# EAGLE design Magnetic-Imaging-Tile (EAGLE 9.5.2)
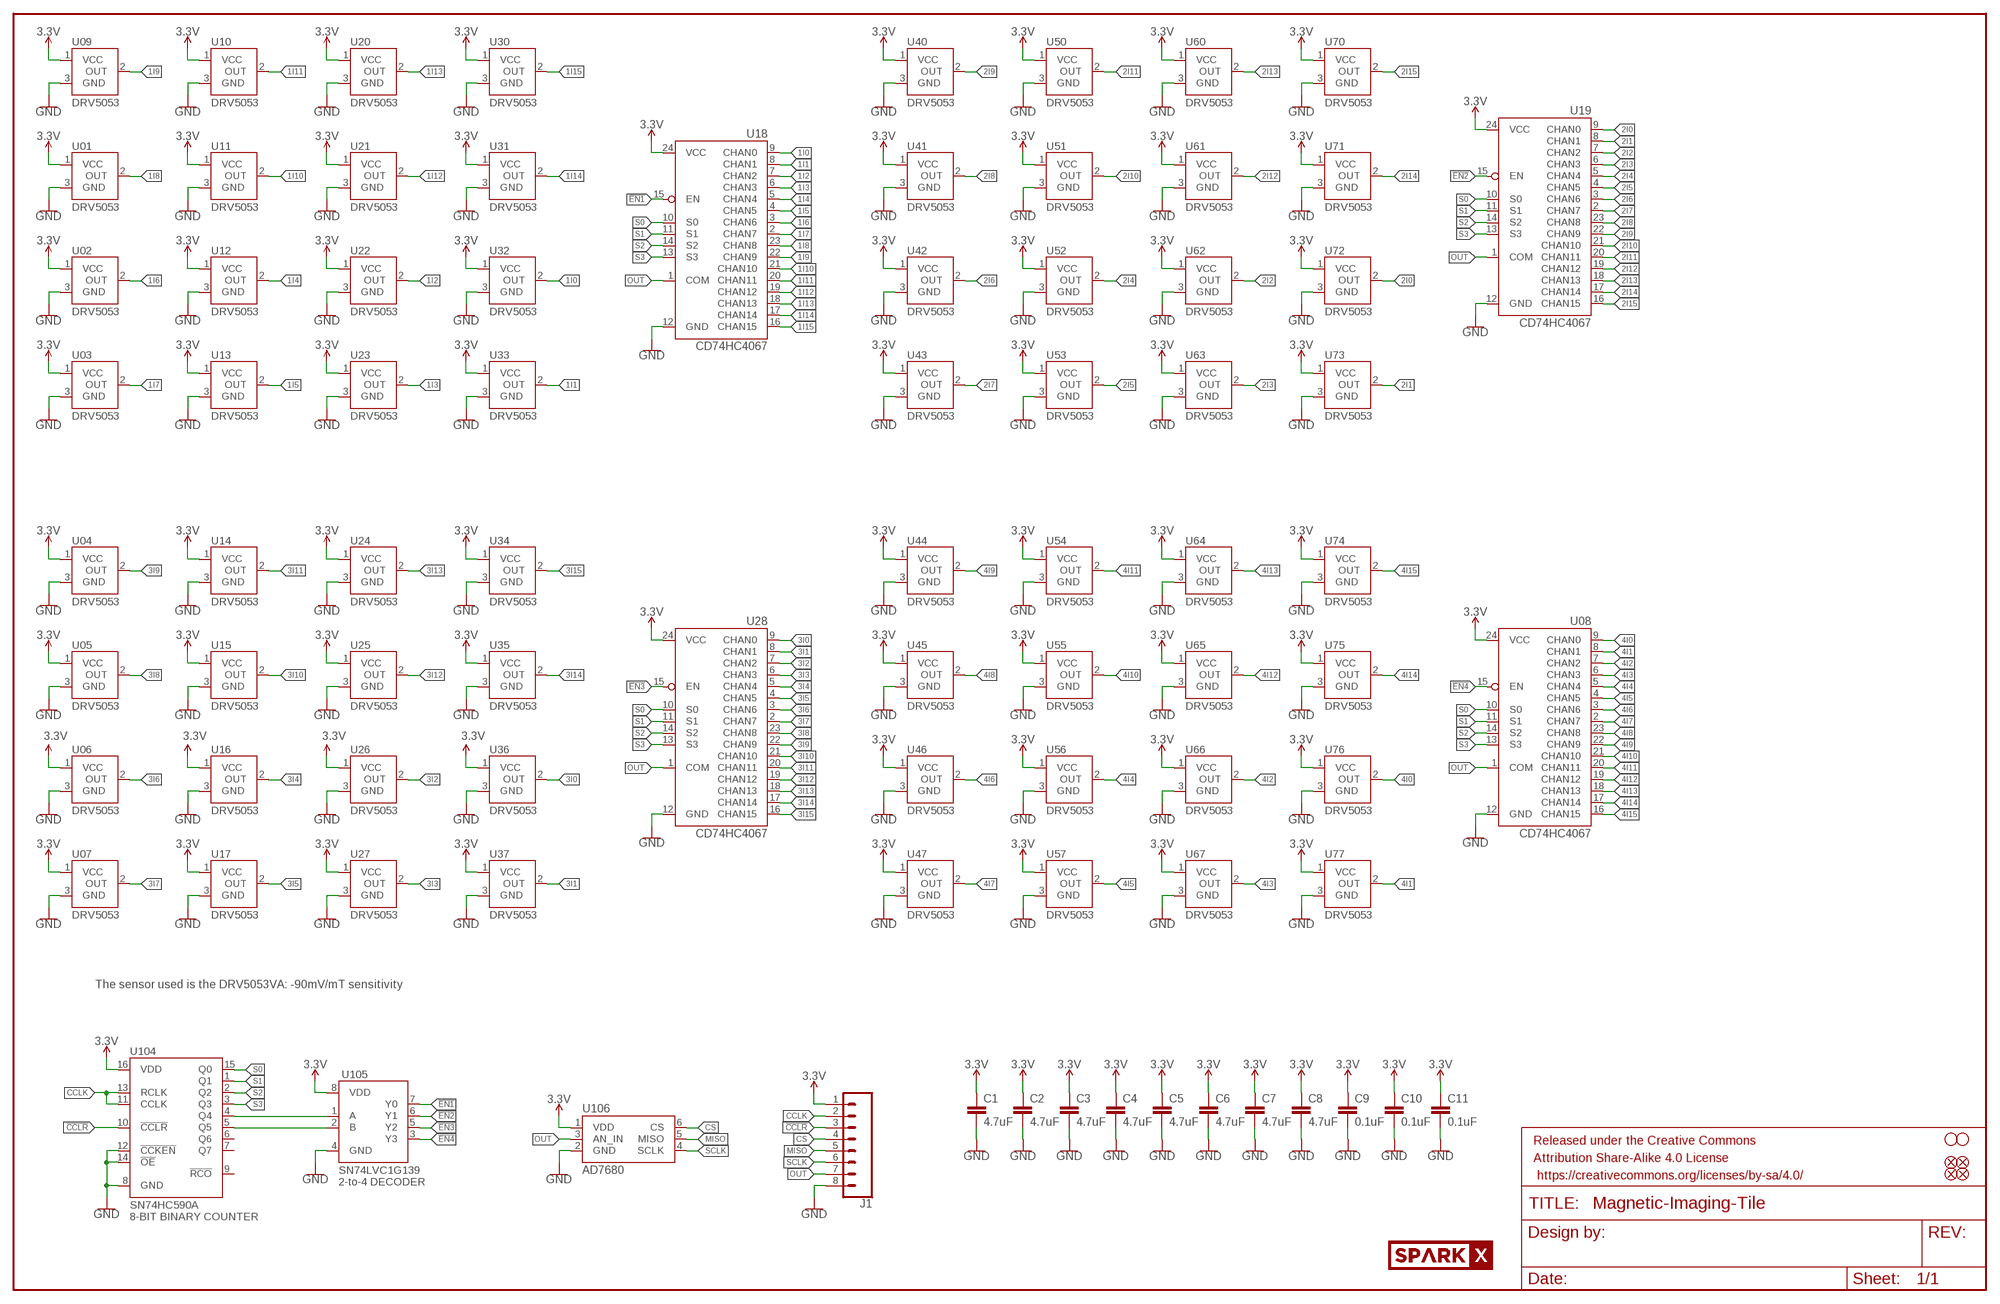
[diagram p0: schematic, sheet 1]

## Parts
C1  4.7uF  4.7UF-0603-6.3V-(10%)  [0603]
C2  4.7uF  4.7UF-0603-6.3V-(10%)  [0603]
C3  4.7uF  4.7UF-0603-6.3V-(10%)  [0603]
C4  4.7uF  4.7UF-0603-6.3V-(10%)  [0603]
C5  4.7uF  4.7UF-0603-6.3V-(10%)  [0603]
C6  4.7uF  4.7UF-0603-6.3V-(10%)  [0603]
C7  4.7uF  4.7UF-0603-6.3V-(10%)  [0603]
C8  4.7uF  4.7UF-0603-6.3V-(10%)  [0603]
C9  0.1uF  0.1UF-0603-25V-(+80/-20%)  [0603]
C10  0.1uF  0.1UF-0603-25V-(+80/-20%)  [0603]
C11  0.1uF  0.1UF-0603-25V-(+80/-20%)  [0603]
FD1  FIDUCIALUFIDUCIAL  [FIDUCIAL-MICRO]
FD2  FIDUCIALUFIDUCIAL  [FIDUCIAL-MICRO]
FD3  FIDUCIALUFIDUCIAL  [FIDUCIAL-MICRO]
FD4  FIDUCIALUFIDUCIAL  [FIDUCIAL-MICRO]
FRAME1  FRAME-LEDGER  [CREATIVE_COMMONS]
H1  STAND-OFF  [STAND-OFF]
H2  STAND-OFF  [STAND-OFF]
J1  CONN_08LOCK_NO_SILK  [1X08_LOCK_NO_SILK]
U01  DRV5053  [SOT23-3]
U02  DRV5053  [SOT23-3]
U03  DRV5053  [SOT23-3]
U04  DRV5053  [SOT23-3]
U05  DRV5053  [SOT23-3]
U06  DRV5053  [SOT23-3]
U07  DRV5053  [SOT23-3]
U08  CD74HC4067  74HC4067SM96  [SSOP24]
U09  DRV5053  [SOT23-3]
U10  DRV5053  [SOT23-3]
U11  DRV5053  [SOT23-3]
U12  DRV5053  [SOT23-3]
U13  DRV5053  [SOT23-3]
U14  DRV5053  [SOT23-3]
U15  DRV5053  [SOT23-3]
U16  DRV5053  [SOT23-3]
U17  DRV5053  [SOT23-3]
U18  CD74HC4067  74HC4067SM96  [SSOP24]
U19  CD74HC4067  74HC4067SM96  [SSOP24]
U20  DRV5053  [SOT23-3]
U21  DRV5053  [SOT23-3]
U22  DRV5053  [SOT23-3]
U23  DRV5053  [SOT23-3]
U24  DRV5053  [SOT23-3]
U25  DRV5053  [SOT23-3]
U26  DRV5053  [SOT23-3]
U27  DRV5053  [SOT23-3]
U28  CD74HC4067  74HC4067SM96  [SSOP24]
U30  DRV5053  [SOT23-3]
U31  DRV5053  [SOT23-3]
U32  DRV5053  [SOT23-3]
U33  DRV5053  [SOT23-3]
U34  DRV5053  [SOT23-3]
U35  DRV5053  [SOT23-3]
U36  DRV5053  [SOT23-3]
U37  DRV5053  [SOT23-3]
U40  DRV5053  [SOT23-3]
U41  DRV5053  [SOT23-3]
U42  DRV5053  [SOT23-3]
U43  DRV5053  [SOT23-3]
U44  DRV5053  [SOT23-3]
U45  DRV5053  [SOT23-3]
U46  DRV5053  [SOT23-3]
U47  DRV5053  [SOT23-3]
U50  DRV5053  [SOT23-3]
U51  DRV5053  [SOT23-3]
U52  DRV5053  [SOT23-3]
U53  DRV5053  [SOT23-3]
U54  DRV5053  [SOT23-3]
U55  DRV5053  [SOT23-3]
U56  DRV5053  [SOT23-3]
U57  DRV5053  [SOT23-3]
U60  DRV5053  [SOT23-3]
U61  DRV5053  [SOT23-3]
U62  DRV5053  [SOT23-3]
U63  DRV5053  [SOT23-3]
U64  DRV5053  [SOT23-3]
U65  DRV5053  [SOT23-3]
U66  DRV5053  [SOT23-3]
U67  DRV5053  [SOT23-3]
U70  DRV5053  [SOT23-3]
U71  DRV5053  [SOT23-3]
U72  DRV5053  [SOT23-3]
U73  DRV5053  [SOT23-3]
U74  DRV5053  [SOT23-3]
U75  DRV5053  [SOT23-3]
U76  DRV5053  [SOT23-3]
U77  DRV5053  [SOT23-3]
U104  SN74HC590A  [SO16]
U105  SN74LVC1G139  [SM8]
U106  AD7680  AD7940  [SOT23-6]
U$1  SPARKX-LOGO3  [SPARKX-SMALL]

## Nets
1I0: U18.9(CHAN0) U32.2(OUT)
1I1: U18.8(CHAN1) U33.2(OUT)
1I2: U18.7(CHAN2) U22.2(OUT)
1I3: U18.6(CHAN3) U23.2(OUT)
1I4: U12.2(OUT) U18.5(CHAN4)
1I5: U13.2(OUT) U18.4(CHAN5)
1I6: U02.2(OUT) U18.3(CHAN6)
1I7: U03.2(OUT) U18.2(CHAN7)
1I8: U01.2(OUT) U18.23(CHAN8)
1I9: U09.2(OUT) U18.22(CHAN9)
1I10: U11.2(OUT) U18.21(CHAN10)
1I11: U10.2(OUT) U18.20(CHAN11)
1I12: U18.19(CHAN12) U21.2(OUT)
1I13: U18.18(CHAN13) U20.2(OUT)
1I14: U18.17(CHAN14) U31.2(OUT)
1I15: U18.16(CHAN15) U30.2(OUT)
2I0: U19.9(CHAN0) U72.2(OUT)
2I1: U19.8(CHAN1) U73.2(OUT)
2I2: U19.7(CHAN2) U62.2(OUT)
2I3: U19.6(CHAN3) U63.2(OUT)
2I4: U19.5(CHAN4) U52.2(OUT)
2I5: U19.4(CHAN5) U53.2(OUT)
2I6: U19.3(CHAN6) U42.2(OUT)
2I7: U19.2(CHAN7) U43.2(OUT)
2I8: U19.23(CHAN8) U41.2(OUT)
2I9: U19.22(CHAN9) U40.2(OUT)
2I10: U19.21(CHAN10) U51.2(OUT)
2I11: U19.20(CHAN11) U50.2(OUT)
2I12: U19.19(CHAN12) U61.2(OUT)
2I13: U19.18(CHAN13) U60.2(OUT)
2I14: U19.17(CHAN14) U71.2(OUT)
2I15: U19.16(CHAN15) U70.2(OUT)
3.3V: C1.1 C2.1 C3.1 C4.1 C5.1 C6.1 C7.1 C8.1 C9.1 C10.1 C11.1 J1.1 U01.1(VCC) U02.1(VCC) U03.1(VCC) U04.1(VCC) U05.1(VCC) U06.1(VCC) U07.1(VCC) U08.24(VCC) U09.1(VCC) U10.1(VCC) U11.1(VCC) U12.1(VCC) U13.1(VCC) U14.1(VCC) U15.1(VCC) U16.1(VCC) U17.1(VCC) U18.24(VCC) U19.24(VCC) U20.1(VCC) U21.1(VCC) U22.1(VCC) U23.1(VCC) U24.1(VCC) U25.1(VCC) U26.1(VCC) U27.1(VCC) U28.24(VCC) U30.1(VCC) U31.1(VCC) U32.1(VCC) U33.1(VCC) U34.1(VCC) U35.1(VCC) U36.1(VCC) U37.1(VCC) U40.1(VCC) U41.1(VCC) U42.1(VCC) U43.1(VCC) U44.1(VCC) U45.1(VCC) U46.1(VCC) U47.1(VCC) U50.1(VCC) U51.1(VCC) U52.1(VCC) U53.1(VCC) U54.1(VCC) U55.1(VCC) U56.1(VCC) U57.1(VCC) U60.1(VCC) U61.1(VCC) U62.1(VCC) U63.1(VCC) U64.1(VCC) U65.1(VCC) U66.1(VCC) U67.1(VCC) U70.1(VCC) U71.1(VCC) U72.1(VCC) U73.1(VCC) U74.1(VCC) U75.1(VCC) U76.1(VCC) U77.1(VCC) U104.16(VDD) U105.8(VDD) U106.1(VDD)
3I0: U28.9(CHAN0) U36.2(OUT)
3I1: U28.8(CHAN1) U37.2(OUT)
3I2: U26.2(OUT) U28.7(CHAN2)
3I3: U27.2(OUT) U28.6(CHAN3)
3I4: U16.2(OUT) U28.5(CHAN4)
3I5: U17.2(OUT) U28.4(CHAN5)
3I6: U06.2(OUT) U28.3(CHAN6)
3I7: U07.2(OUT) U28.2(CHAN7)
3I8: U05.2(OUT) U28.23(CHAN8)
3I9: U04.2(OUT) U28.22(CHAN9)
3I10: U15.2(OUT) U28.21(CHAN10)
3I11: U14.2(OUT) U28.20(CHAN11)
3I12: U25.2(OUT) U28.19(CHAN12)
3I13: U24.2(OUT) U28.18(CHAN13)
3I14: U28.17(CHAN14) U35.2(OUT)
3I15: U28.16(CHAN15) U34.2(OUT)
4I0: U08.9(CHAN0) U76.2(OUT)
4I1: U08.8(CHAN1) U77.2(OUT)
4I2: U08.7(CHAN2) U66.2(OUT)
4I3: U08.6(CHAN3) U67.2(OUT)
4I4: U08.5(CHAN4) U56.2(OUT)
4I5: U08.4(CHAN5) U57.2(OUT)
4I6: U08.3(CHAN6) U46.2(OUT)
4I7: U08.2(CHAN7) U47.2(OUT)
4I8: U08.23(CHAN8) U45.2(OUT)
4I9: U08.22(CHAN9) U44.2(OUT)
4I10: U08.21(CHAN10) U55.2(OUT)
4I11: U08.20(CHAN11) U54.2(OUT)
4I12: U08.19(CHAN12) U65.2(OUT)
4I13: U08.18(CHAN13) U64.2(OUT)
4I14: U08.17(CHAN14) U75.2(OUT)
4I15: U08.16(CHAN15) U74.2(OUT)
!CCLR: J1.3 U104.10(!CCLR)
!EN1: U18.15(EN) U105.7(Y0)
!EN2: U19.15(EN) U105.6(Y1)
!EN3: U28.15(EN) U105.5(Y2)
!EN4: U08.15(EN) U105.3(Y3)
CCLK: J1.2 U104.11(CCLK) U104.13(RCLK)
CS: J1.4 U106.6(CS)
GND: C1.2 C2.2 C3.2 C4.2 C5.2 C6.2 C7.2 C8.2 C9.2 C10.2 C11.2 J1.8 U01.3(GND) U02.3(GND) U03.3(GND) U04.3(GND) U05.3(GND) U06.3(GND) U07.3(GND) U08.12(GND) U09.3(GND) U10.3(GND) U11.3(GND) U12.3(GND) U13.3(GND) U14.3(GND) U15.3(GND) U16.3(GND) U17.3(GND) U18.12(GND) U19.12(GND) U20.3(GND) U21.3(GND) U22.3(GND) U23.3(GND) U24.3(GND) U25.3(GND) U26.3(GND) U27.3(GND) U28.12(GND) U30.3(GND) U31.3(GND) U32.3(GND) U33.3(GND) U34.3(GND) U35.3(GND) U36.3(GND) U37.3(GND) U40.3(GND) U41.3(GND) U42.3(GND) U43.3(GND) U44.3(GND) U45.3(GND) U46.3(GND) U47.3(GND) U50.3(GND) U51.3(GND) U52.3(GND) U53.3(GND) U54.3(GND) U55.3(GND) U56.3(GND) U57.3(GND) U60.3(GND) U61.3(GND) U62.3(GND) U63.3(GND) U64.3(GND) U65.3(GND) U66.3(GND) U67.3(GND) U70.3(GND) U71.3(GND) U72.3(GND) U73.3(GND) U74.3(GND) U75.3(GND) U76.3(GND) U77.3(GND) U104.8(GND) U104.12(!CCKEN) U104.14(!OE) U105.4(GND) U106.2(GND)
MISO: J1.5 U106.5(MISO)
N$7: U104.4(Q4) U105.1(A)
N$8: U104.5(Q5) U105.2(B)
OUT: J1.7 U08.1(COM) U18.1(COM) U19.1(COM) U28.1(COM) U106.3(AN_IN)
S0: U08.10(S0) U18.10(S0) U19.10(S0) U28.10(S0) U104.15(Q0)
S1: U08.11(S1) U18.11(S1) U19.11(S1) U28.11(S1) U104.1(Q1)
S2: U08.14(S2) U18.14(S2) U19.14(S2) U28.14(S2) U104.2(Q2)
S3: U08.13(S3) U18.13(S3) U19.13(S3) U28.13(S3) U104.3(Q3)
SCLK: J1.6 U106.4(SCLK)
Unconnected: U104.6(Q6) U104.7(Q7) U104.9(!RCO)

## Notes on the sheet
- The sensor used is the DRV5053VA: -90mV/mT sensitivity

## Library data of the parts
C1-C8 = SparkFun-Capacitors:4.7UF: 4.7µF ceramic capacitors A capacitor is a passive two-terminal electrical component used to store electrical energy temporarily in an electric field.; PROD_ID: CAP-08280
C9-C11 = SparkFun-Capacitors:0.1UF: 0.1µF ceramic capacitors A capacitor is a passive two-terminal electrical component used to store electrical energy temporarily in an electric field.; PROD_ID: CAP-00810
FD1-FD4 = SparkFun-Aesthetics:FIDUCIAL: Fiducial Alignment Points Point-of-reference for pick-and-place machines and other optical instruments.
FRAME1 = SparkFun-Aesthetics:FRAME-LEDGER: Schematic Frame - Ledger Standard 11x14 US Ledger frame
H1 H2 = SparkFun-Hardware:STAND-OFF: Stand Off Drill holes for mechanically mounting via screws, standoffs, etc. Note: Use the keepout ring to avoid running the screw head into surrounding components. Variant Overviews STAND-OFF - Mechanical footprint for a #4 phillips button head screw. STAND-OFF-TIGHT - Mechanical footprint for a #4 phillips button head screw, Example SparkFun Products Screw - Phillips Head (1/4", 4-40, 10 pack) <https://www.sparkfun.com/products/10453> (PRT-10453) Screw - Phillips Head (1/2", 4-40, 10 pack) <https://www.sparkfun.com/products/10452> (PRT-10452) Screw - Phillips Head (3/4", 4-40, 10 pack) <https://www.sparkfun.com/products/10451> (PRT-10451) Screw - Phillips Head (1", 4-40, 10 pack) <https://www.sparkfun.com/products/10450> (PRT-10450)
J1 = SparkFun-Connectors:CONN_08: Multi connection point. Often used as Generic Header-pin footprint for 0.1 inch spaced/style header connections On any of the 0.1 inch spaced packages, you can populate with these: Break Away Headers - Straight <https://www.sparkfun.com/products/116> (PRT-00116) Break Away Male Headers - Right Angle <https://www.sparkfun.com/products/553> (PRT-00553) Female Headers <https://www.sparkfun.com/products/115> (PRT-00115) Break Away Headers - Machine Pin <https://www.sparkfun.com/products/117> (PRT-00117) Break Away Female Headers - Swiss Machine Pin <https://www.sparkfun.com/products/743> (PRT-00743) Arduino Stackable Header - 8 Pin <https://www.sparkfun.com/products/9279> (PRT-09279) For SCREWTERMINALS and SPRING TERMINALS visit here: Screw Terimnals on SparkFun.com <https://www.sparkfun.com/search/results?term=Screw+Terminals> (5mm/3.5mm/2.54mm spacing) This device is also useful as a general connection point to wire up your design to another part of your project. Our various solder wires solder well into these plated through hole pads. Hook-Up Wire - Assortment (Stranded, 22 AWG) <https://www.sparkfun.com/products/11375> (PRT-11375) Hook-Up Wire - Assortment (Solid Core, 22 AWG) <https://www.sparkfun.com/products/11367> (PRT-11367) View the entire wire category on our website here <https://www.sparkfun.com/categories/141> Special notes: Molex polarized connector foot print use with SKU : PRT-08231 with associated crimp pins and housings. 1MM SMD Version SKU: PRT-10208 NOTES ON THE VARIANTS LOCK and LOCK_LONGPADS... This footprint was designed to help hold the alignment of a through-hole component (i.e. 6-pin header) while soldering it into place. You may notice that each hole has been shifted either up or down by 0.005 of an inch from it's more standard position (which is a perfectly straight line). This slight alteration caused the pins (the squares in the middle) to touch the edges of the holes. Because they are alternating, it causes a "brace" to hold the component in place. 0.005 has proven to be the perfect amount of "off-center" position when using our standard breakaway headers. Although looks a little odd when you look at the bare footprint, once you have a header in there, the alteration is very hard to notice. Also,if you push a header all the way into place, it is covered up entirely on the bottom side.
U01-U07 U09 U10-U17 U20-U27 U30-U37 U40-U47 U50-U57 U60-U67 U70-U77 = Magnetic-Imaging-Tile:DRV5053: TI DRV5053 Hall Effect Magnetic Field Sensor with Analog Output; PROD_ID: IC-14785
U08 U18 U19 U28 = SparkFun-IC-Logic:74*4067: 16-channel analog MUX Datasheet <http://www.sparkfun.com/datasheets/IC/cd74hc4067.pdf> SparkFun Products MP3 Trigger <https://www.sparkfun.com/products/13720> (WIG-13720) SparkFun Analog/Digital MUX Breakout - CD74HC4067 <https://www.sparkfun.com/products/9056> (BOB-09056); PROD_ID: IC-08252; VALUE: CD74HC4067SM96
U104 = Magnetic-Imaging-Tile:SN74HC590A: SN74HC509A 8-bit Binary Counter, 2-6V operation; PROD_ID: IC-14788
U105 = Magnetic-Imaging-Tile:SN74LVC1G139: SN74LVC1G139 2-to-4 Line Decoder, 1.65-5.5V operation; PROD_ID: IC-14790
U106 = Magnetic-Imaging-Tile:AD7940: Analog Devices AD7940BRJZ 14-bit ADC, 100k Samples/sec sample rate, 2.5-5V single supply; PROD_ID: IC-14789
U$1 = SparkX:SPARKX-LOGO

## Board
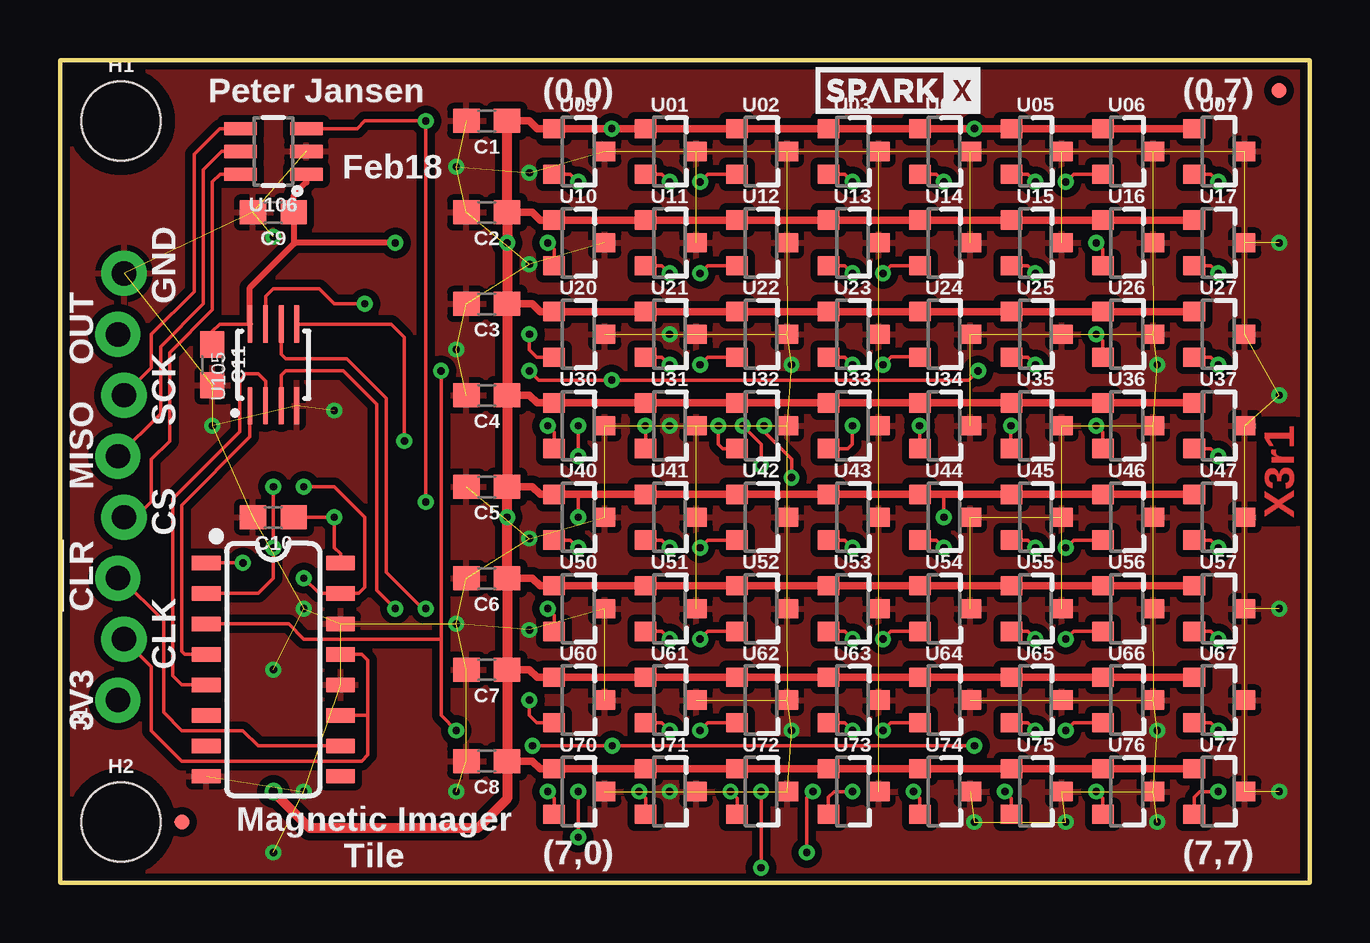
[diagram p1: board, top side]
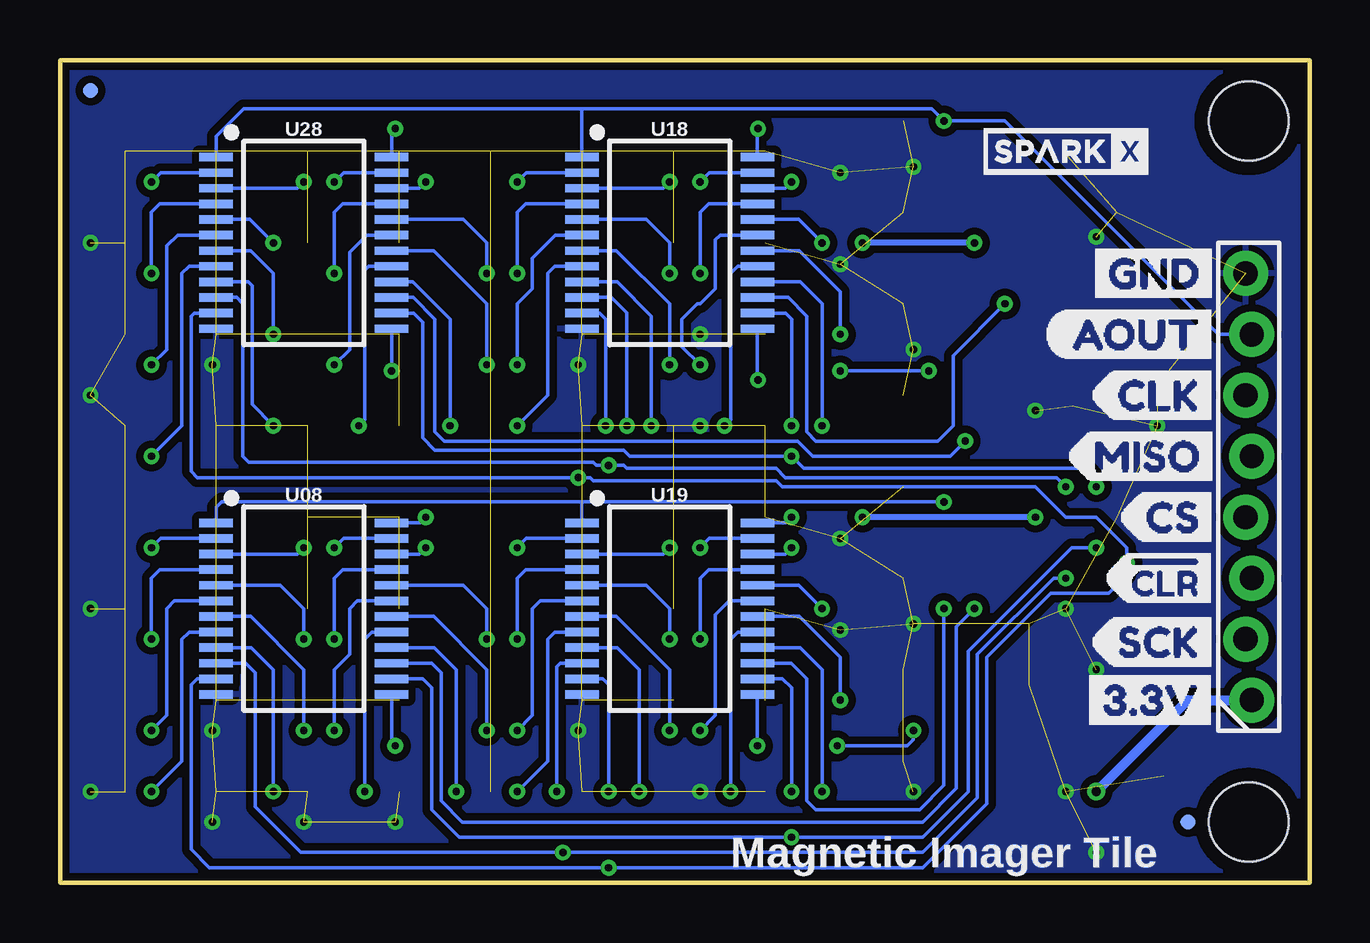
[diagram p2: board, bottom side, seen from below]

Size 52.07 x 34.29 mm. Coordinates in mm from the lower left corner, seen from the top.
Outline: 0,0 52.07,0 52.07,34.29 0,34.29 0,0
Copper layers (1*16): Top 0.035mm / dielectric 1.5mm / Bottom 0.035mm
Design rules "SparkFun-2-layer-PCBWay-LIMIT": minimum track width 6mil, minimum drill 0.3mm, track to track 6mil, track to pad 6mil, pad to pad 6mil, via to via 6mil, smd to smd 6mil, copper to edge 6mil, drill to drill 6mil, minimum pad ring 7mil, minimum via ring 7mil, stop-mask expansion 4mil, vias tented up to drill 25mil, thermal gap 10mil

### Footprints (pad centres in the part's own frame; a part is rotated, then mirrored left to right if it is on the bottom)
0603 = smd 1.1 x 1: 1 -0.85,0; 2 0.85,0
FIDUCIAL-MICRO = smd 0.635 x 0.635: 1 0,0
STAND-OFF = hole 3.302: 0,0
1X08_LOCK_NO_SILK = drill 1.016 pad 1.88: 1 0,0.127; 2 2.54,-0.127; 3 5.08,0.127; 4 7.62,-0.127; 5 10.16,0.127; 6 12.7,-0.127; 7 15.24,0.127; 8 17.78,-0.127
SOT23-3 = smd 0.8 x 0.9: 1 -0.95,-1; 2 0.95,-1; 3 0,1.1
SSOP24 = smd 0.348 x 1.397: 1 -3.575,-3.656; 2 -2.925,-3.656; 3 -2.275,-3.656; 4 -1.625,-3.656; 5 -0.975,-3.656; 6 -0.325,-3.656; 7 0.325,-3.656; 8 0.975,-3.656; 9 1.625,-3.656; 10 2.275,-3.656; 11 2.925,-3.656; 12 3.575,-3.656; 13 3.575,3.656; 14 2.925,3.656; 15 2.275,3.656; 16 1.625,3.656; 17 0.975,3.656; 18 0.325,3.656; 19 -0.325,3.656; 20 -0.975,3.656; 21 -1.625,3.656; 22 -2.275,3.656; 23 -2.925,3.656; 24 -3.575,3.656
SO16 = smd 0.6 x 1.2: 1 -4.445,-2.8; 2 -3.175,-2.8; 3 -1.905,-2.8; 4 -0.635,-2.8; 5 0.635,-2.8; 6 1.905,-2.8; 7 3.175,-2.8; 8 4.445,-2.8; 9 4.445,2.8; 10 3.175,2.8; 11 1.905,2.8; 12 0.635,2.8; 13 -0.635,2.8; 14 -1.905,2.8; 15 -3.175,2.8; 16 -4.445,2.8
SM8 = smd 1.55 x 0.25: 1 -1.7,0.975; 2 -1.7,0.325; 3 -1.7,-0.325; 4 -1.7,-0.975; 5 1.7,-0.975; 6 1.7,-0.325; 7 1.7,0.325; 8 1.7,0.975
SOT23-6 = smd 0.55 x 1.35: 1 -0.95,-1.375; 2 0,-1.375; 3 0.95,-1.375; 4 0.95,1.375; 5 0,1.375; 6 -0.95,1.375

### Placement (x,y rotation side)
C1  17.78,31.75 180 top
C2  17.78,27.94 180 top
C3  17.78,24.13 180 top
C4  17.78,20.32 180 top
C5  17.78,16.51 180 top
C6  17.78,12.7 180 top
C7  17.78,8.89 180 top
C8  17.78,5.08 180 top
C9  8.89,27.94 180 top
C10  8.89,15.24 180 top
C11  6.35,21.59 270 top
FD1  50.8,33.02 90 top
FD2  5.08,2.54 90 top
FD3  5.08,2.54 90 bottom
FD4  50.8,33.02 90 bottom
FRAME1  -8.89,-12.7 0 top  (outside the outline)
H1  2.54,31.75 0 top
H2  2.54,2.54 0 top
J1  2.54,7.62 90 top
U01  25.4,30.48 270 top
U02  29.21,30.48 270 top
U03  33.02,30.48 270 top
U04  36.83,30.48 270 top
U05  40.64,30.48 270 top
U06  44.45,30.48 270 top
U07  48.26,30.48 270 top
U08  41.91,11.43 270 bottom
U09  21.59,30.48 270 top
U10  21.59,26.67 270 top
U11  25.4,26.67 270 top
U12  29.21,26.67 270 top
U13  33.02,26.67 270 top
U14  36.83,26.67 270 top
U15  40.64,26.67 270 top
U16  44.45,26.67 270 top
U17  48.26,26.67 270 top
U18  26.67,26.67 270 bottom
U19  26.67,11.43 270 bottom
U20  21.59,22.86 270 top
U21  25.4,22.86 270 top
U22  29.21,22.86 270 top
U23  33.02,22.86 270 top
U24  36.83,22.86 270 top
U25  40.64,22.86 270 top
U26  44.45,22.86 270 top
U27  48.26,22.86 270 top
U28  41.91,26.67 270 bottom
U30  21.59,19.05 270 top
U31  25.4,19.05 270 top
U32  29.21,19.05 270 top
U33  33.02,19.05 270 top
U34  36.83,19.05 270 top
U35  40.64,19.05 270 top
U36  44.45,19.05 270 top
U37  48.26,19.05 270 top
U40  21.59,15.24 270 top
U41  25.4,15.24 270 top
U42  29.21,15.24 270 top
U43  33.02,15.24 270 top
U44  36.83,15.24 270 top
U45  40.64,15.24 270 top
U46  44.45,15.24 270 top
U47  48.26,15.24 270 top
U50  21.59,11.43 270 top
U51  25.4,11.43 270 top
U52  29.21,11.43 270 top
U53  33.02,11.43 270 top
U54  36.83,11.43 270 top
U55  40.64,11.43 270 top
U56  44.45,11.43 270 top
U57  48.26,11.43 270 top
U60  21.59,7.62 270 top
U61  25.4,7.62 270 top
U62  29.21,7.62 270 top
U63  33.02,7.62 270 top
U64  36.83,7.62 270 top
U65  40.64,7.62 270 top
U66  44.45,7.62 270 top
U67  48.26,7.62 270 top
U70  21.59,3.81 270 top
U71  25.4,3.81 270 top
U72  29.21,3.81 270 top
U73  33.02,3.81 270 top
U74  36.83,3.81 270 top
U75  40.64,3.81 270 top
U76  44.45,3.81 270 top
U77  48.26,3.81 270 top
U104  8.89,8.89 270 top
U105  8.89,21.59 90 top
U106  8.89,30.48 90 top
U$1  34.92,33.02 0 top
U$2  SPARKX-LOGO3  [SPARKX-SMALL]  10.16,30.48 0 bottom
U$3  [GND]  9.53,25.4 0 bottom
U$4  [#CLR]  8.76,12.7 0 bottom
U$5  [3#3V]  9.78,7.62 0 bottom
U$6  [AOUT]  11.05,22.86 0 bottom
U$7  [CLK]  9.14,20.32 0 bottom
U$8  [MISO]  10.16,17.78 0 bottom
U$9  [SCK]  9.14,10.03 0 bottom
U$10  [CS]  8,15.24 0 bottom

### Tracks (layer width: path | path; a pad name or v marks a point on that pad's centre or on a via)
1I0  (via drill 0.3)
  Top 0.152: U32.2 27.62,18.1 27.43,18.29 v27.43,19.05
  Bottom 0.152: U18.9 28.86,25.05 27.43,23.62 v27.43,19.05
1I1  (via drill 0.3)
  Top 0.152: U33.2 32.83,18.1 33.02,18.29 v33.02,19.05
  Bottom 0.152: U18.8 31.45,25.7 31.75,25.4 31.75,20.32 v33.02,19.05
1I2  (via drill 0.3)
  Top 0.152: U22.2 26.99,21.91 v26.67,21.59
  Bottom 0.152: U18.7 28.89,26.34 26.67,24.13 v26.67,21.59
1I3  (via drill 0.3)
  Top 0.152: U23.2 32.7,21.91 v33.02,21.59
  Bottom 0.152: U18.6 31.43,27 32.38,26.04 32.38,24.77 33.02,24.13 v33.02,21.59
1I4  (via drill 0.3)
  Top 0.152: U12.2 26.99,25.72 v26.67,25.4
  Bottom 0.152: U18.5 27.64,27.64 26.67,26.67 v26.67,25.4
1I5  (via drill 0.3)
  Top 0.152: U13.2 32.7,25.72 v33.02,25.4
  Bottom 0.152: U18.4 32.66,28.3 33.02,27.94 v33.02,25.4
1I6  (via drill 0.3)
  Top 0.152: U02.2 26.99,29.53 v26.67,29.21
  Bottom 0.152: U18.3 26.93,28.95 v26.67,29.21
1I7  (via drill 0.3)
  Top 0.152: U03.2 32.7,29.53 v33.02,29.21
  Bottom 0.152: U18.2 32.63,29.59 v33.02,29.21
1I8  (via drill 0.3)
  Top 0.152: U01.2 25.08,29.53 v25.4,29.21
  Bottom 0.152: U18.23 25.02,29.59 v25.4,29.21
1I9  (via drill 0.3)
  Top 0.152: U09.2 21.27,29.53 v21.59,29.21
  Bottom 0.152: U18.22 21.86,28.95 v21.59,29.21
1I10  (via drill 0.3)
  Top 0.152: U11.2 25.08,25.72 v25.4,25.4
  Bottom 0.152: U18.21 25.05,28.3 25.4,27.94 v25.4,25.4
1I11  (via drill 0.3)
  Top 0.152: U10.2 20.59,26.4 v20.32,26.67
  Bottom 0.152: U18.20 21.3,27.64 v20.32,26.67
1I12  (via drill 0.3)
  Top 0.152: U21.2 25.08,21.91 v25.4,21.59
  Bottom 0.152: U18.19 24.57,27 24.77,26.8 24.77,24.77 25.4,24.13 25.53,24.13 26.16,23.5 26.16,22.35 v25.4,21.59
1I13  (via drill 0.3)
  Top 0.152: U20.2 19.87,21.91 19.56,22.23 v19.56,22.86
  Bottom 0.152: U18.18 21.27,26.34 19.56,24.64 v19.56,22.86
1I14  (via drill 0.3)
  Top 0.152: U31.2 24.4,19.03 v24.38,19.05
  Bottom 0.152: U18.17 23.84,25.7 24.13,25.4 24.13,19.3 v24.38,19.05
1I15  (via drill 0.3)
  Top 0.152: U30.2 20.59,18.78 v20.32,19.05
  Bottom 0.152: U18.16 21.23,25.05 20.32,24.13 v20.32,19.05
2I0  (via drill 0.3)
  Top 0.152: U72.2 28.21,3.54 v27.94,3.81
  Bottom 0.152: U19.9 28.86,9.8 27.94,8.89 v27.94,3.81
2I1  (via drill 0.3)
  Top 0.152: U73.2 32.02,3.57 32.26,3.81 v33.02,3.81
  Bottom 0.152: U19.8 31.45,10.46 31.75,10.16 31.75,5.08 v33.02,3.81
2I2  (via drill 0.3)
  Top 0.152: U62.2 26.99,6.67 v26.67,6.35
  Bottom 0.152: U19.7 28.89,11.11 26.67,8.89 v26.67,6.35
2I3  (via drill 0.3)
  Top 0.152: U63.2 32.7,6.67 v33.02,6.35
  Bottom 0.152: U19.6 32.06,11.76 32.38,11.43 32.38,6.99 v33.02,6.35
2I4  (via drill 0.3)
  Top 0.152: U52.2 26.99,10.48 v26.67,10.16
  Bottom 0.152: U19.5 27.64,12.4 26.67,11.43 v26.67,10.16
2I5  (via drill 0.3)
  Top 0.152: U53.2 32.7,10.48 v33.02,10.16
  Bottom 0.152: U19.4 32.66,13.05 33.02,12.7 v33.02,10.16
2I6  (via drill 0.3)
  Top 0.152: U42.2 26.99,14.29 v26.67,13.97
  Bottom 0.152: U19.3 26.93,13.71 v26.67,13.97
2I7  (via drill 0.3)
  Top 0.152: U43.2 32.7,14.29 v33.02,13.97
  Bottom 0.152: U19.2 32.63,14.36 v33.02,13.97
2I8  (via drill 0.3)
  Top 0.152: U41.2 25.08,14.29 v25.4,13.97
  Bottom 0.152: U19.23 25.02,14.36 v25.4,13.97
2I9  (via drill 0.3)
  Top 0.152: U40.2 21.27,14.29 v21.59,13.97
  Bottom 0.152: U19.22 21.86,13.71 v21.59,13.97
2I10  (via drill 0.3)
  Top 0.152: U51.2 25.08,10.48 v25.4,10.16
  Bottom 0.152: U19.21 25.05,13.05 25.4,12.7 v25.4,10.16
2I11  (via drill 0.3)
  Top 0.152: U50.2 20.59,11.16 v20.32,11.43
  Bottom 0.152: U19.20 21.3,12.4 v20.32,11.43
2I12  (via drill 0.3)
  Top 0.152: U61.2 25.08,6.67 v25.4,6.35
  Bottom 0.152: v25.4,6.35 24.77,6.99 24.77,11.18 24.19,11.76 U19.19
2I13  (via drill 0.3)
  Top 0.152: U60.2 19.87,6.67 19.56,6.99 v19.56,7.62
  Bottom 0.152: U19.18 21.27,11.11 19.56,9.4 v19.56,7.62
2I14  (via drill 0.3)
  Top 0.152: U71.2 24.4,3.54 v24.13,3.81
  Bottom 0.152: U19.17 23.84,10.46 24.13,10.16 v24.13,3.81
2I15  (via drill 0.3)
  Top 0.152: U70.2 20.59,3.54 v20.32,3.81
  Bottom 0.152: U19.16 21.23,9.8 20.32,8.89 v20.32,3.81
3.3V  (via drill 0.3, 0.38)
  Top 0.152: v21.59,15.24 21.59,16.19 | v36.83,15.24 36.83,16.19 | U105.8 6.65,23.29 6.35,22.99 C11.1 | C10.1 v11.43,15.24 | 11.68,15.24 v11.43,15.24 | U104.16 11.69,13.71 11.43,13.97 v11.43,15.24
  Top 0.254: U105.8 7.92,24.81 9.74,26.63 | 9.74,26.63 C9.1 9.74,28.66 10.27,29.19 U106.1 | v13.97,26.67 9.78,26.67 9.74,26.63
  Top 0.305: U07.1 U06.1 U05.1 v38.1,31.43 U04.1 U03.1 U02.1 U01.1 v22.99,31.43 U09.1 19.88,31.43 19.56,31.75 C1.1 | U17.1 U16.1 U15.1 U14.1 U13.1 U12.1 U11.1 U10.1 20,27.62 19.68,27.94 C2.1 | U27.1 U26.1 U25.1 U24.1 U23.1 U22.1 U21.1 U20.1 20,23.81 19.68,24.13 C3.1 | U37.1 U36.1 U35.1 U34.1 U33.1 U32.1 U31.1 U30.1 19.88,20 19.56,20.32 C4.1 | U47.1 U46.1 U45.1 36.83,16.19 U44.1 U43.1 U42.1 U41.1 21.59,16.19 U40.1 20,16.19 19.68,16.51 C5.1 | U57.1 U56.1 U55.1 U54.1 U53.1 U52.1 U51.1 U50.1 20,12.38 19.68,12.7 C6.1 | U67.1 U66.1 U65.1 U64.1 U63.1 U62.1 U61.1 U60.1 19.88,8.57 19.56,8.89 C7.1 | U77.1 U76.1 U75.1 U74.1 U73.1 U72.1 U71.1 U70.1 20,4.76 19.68,5.08 C8.1 | 12.8,2.29
  Top 0.406: 12.93,2.29 12.8,2.29 10.41,2.29 v8.89,3.81 | C1.1 C2.1 v18.63,26.67 C3.1 C4.1 C5.1 v18.63,15.24 C6.1 C7.1 C8.1 18.63,3.52 17.4,2.29 12.8,2.29
  Bottom 0.152: U28.24 38.25,31.28 v38.1,31.43 | U18.24 23.01,31.4 v22.99,31.43 | U19.24 21.82,15.01 v21.59,15.24 | U08.24 37.06,15.01 v36.83,15.24
  Bottom 0.254: v13.97,26.67 v18.63,26.67 | v11.43,15.24 v18.63,15.24
  Bottom 0.406: v8.89,3.81 5.08,7.62 J1.1
3I0  (via drill 0.3)
  Top 0.152: U36.2 43.45,18.78 v43.18,19.05
  Bottom 0.152: U28.9 44.22,25.05 44.07,24.89 44.07,19.94 v43.18,19.05
3I1  (via drill 0.3)
  Top 0.152: U37.2 47.94,18.1 v48.26,17.78
  Bottom 0.152: U28.8 46.7,25.7 46.99,25.4 46.99,19.05 v48.26,17.78
3I2  (via drill 0.3)
  Top 0.152: U26.2 43.45,22.59 v43.18,22.86
  Bottom 0.152: U28.7 44.12,26.34 43.18,25.4 v43.18,22.86
3I3  (via drill 0.3)
  Top 0.152: U27.2 47.94,21.91 v48.26,21.59
  Bottom 0.152: v48.26,21.59 47.62,22.23 47.62,26.54 47.17,27 U28.6
3I4  (via drill 0.3)
  Top 0.152: U16.2 43.45,26.4 v43.18,26.67
  Bottom 0.152: U28.5 44.16,27.64 v43.18,26.67
3I5  (via drill 0.3)
  Top 0.152: U17.2 47.94,25.72 v48.26,25.4
  Bottom 0.152: U28.4 47.91,28.3 48.26,27.94 v48.26,25.4
3I6  (via drill 0.3)
  Top 0.152: U06.2 42.23,29.53 v41.91,29.21
  Bottom 0.152: U28.3 42.17,28.95 v41.91,29.21
3I7  (via drill 0.3)
  Top 0.152: U07.2 47.94,29.53 v48.26,29.21
  Bottom 0.152: U28.2 47.88,29.59 v48.26,29.21
3I8  (via drill 0.3)
  Top 0.152: U05.2 40.32,29.53 v40.64,29.21
  Bottom 0.152: U28.23 40.26,29.59 v40.64,29.21
3I9  (via drill 0.3)
  Top 0.152: U04.2 36.51,29.53 v36.83,29.21
  Bottom 0.152: U28.22 37.09,28.95 v36.83,29.21
3I10  (via drill 0.3)
  Top 0.152: U15.2 40.32,25.72 v40.64,25.4
  Bottom 0.152: U28.21 40.28,28.3 40.64,27.94 v40.64,25.4
3I11  (via drill 0.3)
  Top 0.152: U14.2 34.61,25.72 v34.29,25.4
  Bottom 0.152: U28.20 35.27,27.64 34.29,26.67 v34.29,25.4
3I12  (via drill 0.3)
  Top 0.152: U25.2 40.32,21.91 v40.64,21.59
  Bottom 0.152: U28.19 39.3,27 40.01,26.29 40.01,22.23 v40.64,21.59
3I13  (via drill 0.3)
  Top 0.152: U24.2 35.81,21.93 34.63,21.93 v34.29,21.59
  Bottom 0.152: U28.18 36.51,26.34 34.29,24.13 v34.29,21.59
3I14  (via drill 0.3)
  Top 0.152: v39.62,19.05 39.62,18.12 U35.2
  Bottom 0.152: U28.17 39.2,25.7 39.37,25.53 39.37,19.3 v39.62,19.05
3I15  (via drill 0.3)
  Top 0.152: U34.2 35.83,19.03 v35.81,19.05
  Bottom 0.152: U28.16 37.36,25.05 35.81,23.5 v35.81,19.05
4I0  (via drill 0.3)
  Top 0.152: U76.2 43.45,3.54 v43.18,3.81
  Bottom 0.152: U08.9 44.09,9.8 43.18,8.89 v43.18,3.81
4I1  (via drill 0.3)
  Top 0.152: U77.2 47.26,3.57 47.5,3.81 v48.26,3.81
  Bottom 0.152: U08.8 46.7,10.46 46.99,10.16 46.99,5.08 v48.26,3.81
4I2  (via drill 0.3)
  Top 0.152: U66.2 42.23,6.67 v41.91,6.35
  Bottom 0.152: U08.7 44.12,11.11 41.91,8.89 v41.91,6.35
4I3  (via drill 0.3)
  Top 0.152: U67.2 47.94,6.67 v48.26,6.35
  Bottom 0.152: U08.6 47.3,11.76 47.62,11.43 47.62,6.99 v48.26,6.35
4I4  (via drill 0.3)
  Top 0.152: U56.2 42.23,10.48 v41.91,10.16
  Bottom 0.152: U08.5 42.88,12.4 41.91,11.43 v41.91,10.16
4I5  (via drill 0.3)
  Top 0.152: U57.2 47.94,10.48 v48.26,10.16
  Bottom 0.152: U08.4 47.91,13.05 48.26,12.7 v48.26,10.16
4I6  (via drill 0.3)
  Top 0.152: U46.2 42.23,14.29 v41.91,13.97
  Bottom 0.152: U08.3 42.17,13.71 v41.91,13.97
4I7  (via drill 0.3)
  Top 0.152: U47.2 47.94,14.29 v48.26,13.97
  Bottom 0.152: U08.2 47.88,14.36 v48.26,13.97
4I8  (via drill 0.3)
  Top 0.152: U45.2 40.32,14.29 v40.64,13.97
  Bottom 0.152: U08.23 40.26,14.36 v40.64,13.97
4I9  (via drill 0.3)
  Top 0.152: U44.2 36.51,14.29 v36.83,13.97
  Bottom 0.152: U08.22 37.09,13.71 v36.83,13.97
4I10  (via drill 0.3)
  Top 0.152: U55.2 40.32,10.48 v40.64,10.16
  Bottom 0.152: U08.21 40.28,13.05 40.64,12.7 v40.64,10.16
4I11  (via drill 0.3)
  Top 0.152: U54.2 34.61,10.48 v34.29,10.16
  Bottom 0.152: U08.20 35.27,12.4 34.29,11.43 v34.29,10.16
4I12  (via drill 0.3)
  Top 0.152: U65.2 40.32,6.67 v40.64,6.35
  Bottom 0.152: U08.19 39.68,11.76 40.01,11.43 40.01,9.53 40.64,8.89 v40.64,6.35
4I13  (via drill 0.3)
  Top 0.152: U64.2 34.61,6.67 v34.29,6.35
  Bottom 0.152: U08.18 36.51,11.11 34.29,8.89 v34.29,6.35
4I14  (via drill 0.3)
  Top 0.152: U75.2 39.64,3.54 v39.37,3.81
  Bottom 0.152: U08.17 39.08,10.46 39.37,10.16 v39.37,3.81
4I15  (via drill 0.3)
  Top 0.152: U74.2 35.83,3.54 v35.56,3.81
  Bottom 0.152: U08.16 36.48,9.8 35.56,8.89 v35.56,3.81
!CCLR
  Top 0.152: U104.10 8.26,5.71 7.62,6.35 5.08,6.35 4.32,7.11 4.32,10.92 2.54,12.7 J1.3
!EN1  (via drill 0.3)
  Top 0.152: U105.7 8.56,24.44 8.89,24.77 10.79,24.77 11.43,24.13 v12.7,24.13
  Bottom 0.152: U18.15 21.73,24.39 20.95,23.62 20.95,18.8 20.57,18.41 15.49,18.41 14.86,19.05 14.86,21.97 v12.7,24.13
!EN2  (via drill 0.3)
  Top 0.152: U105.6 9.21,22.03 9.4,21.84 11.94,21.84 13.59,20.19 13.59,12.95 15.11,11.43 v15.24,11.43
  Bottom 0.152: v15.24,11.43 15.24,4.06 16.26,3.05 20.57,3.05 20.95,3.43 20.95,8.51 21.6,9.15 U19.15
!EN3  (via drill 0.3)
  Top 0.152: v14.35,18.41 14.35,22.73 13.79,23.29 U105.5
  Bottom 0.152: U28.15 37.35,24.39 36.45,23.5 36.45,18.8 36.07,18.41 21.34,18.41 20.7,17.78 14.99,17.78 v14.35,18.41
!EN4  (via drill 0.3)
  Top 0.152: v13.97,11.43 13.21,12.19 13.21,19.94 11.81,21.34 9.4,21.34 9.21,21.15 U105.3
  Bottom 0.152: U08.15 36.59,9.15 36.2,8.76 36.2,3.43 35.31,2.54 16.13,2.54 14.73,3.94 14.73,10.67 v13.97,11.43
CCLK
  Top 0.152: U104.13 12.57,9.53 12.83,9.27 12.83,6.99 | U104.11 12.83,6.99 | 12.83,6.99 12.83,5.33 12.57,5.08 5.08,5.08 3.81,6.35 3.81,9.02 J1.2
CS
  Top 0.152: J1.4 3.17,15.24 3.81,15.88 3.81,17.65 4.57,18.41 4.57,22.1 6.35,23.88 6.35,29.21 6.67,29.53 U106.6
GND  (via drill 0.3)  (113 unrouted)
  other vias: 8.89,8.89 16.51,10.79 50.8,3.81 50.8,11.43 50.8,20.32 50.8,26.67 16.51,29.84 16.51,22.23 8.89,26.92 11.43,19.68 6.35,19.05 16.51,3.81 45.72,6.35 30.48,6.35 30.48,21.59 45.72,21.59 10.16,3.81 25.4,3.81 8.89,1.27 25.4,19.05 25.4,22.86 10.16,11.43 38.1,2.54 41.91,2.54 45.72,2.54 19.56,10.54 19.56,14.35 19.56,25.78 19.56,29.59
  pour Top (isolate 0.305): 0,34.29 0,0 52.07,0 52.07,34.29
  pour Bottom (isolate 0.305): 0,34.29 0,0 52.07,0 52.07,34.29
MISO
  Top 0.152: J1.5 4.19,19.56 4.19,22.35 5.97,24.13 5.97,29.72 6.73,30.48 U106.5
N$7
  Top 0.152: U104.4 5.21,9.53 5.08,9.65 5.08,15.75 7.92,18.58 U105.1
N$8
  Top 0.152: U104.5 5.08,8.26 4.7,8.64 4.7,16 7.49,18.8 7.49,20.95 7.75,21.21 8.26,21.21 8.56,20.9 U105.2
OUT  (via drill 0.3)
  Top 0.152: v15.24,15.88 v15.24,31.75 12.7,31.75 12.38,31.43 U106.3
  Bottom 0.152: U28.1 45.57,31.11 44.42,32.26 30.35,32.26 | U18.1 30.33,32.23 30.35,32.26 | 30.35,32.26 15.75,32.26 v15.24,31.75 12.7,31.75 3.81,22.86 J1.7 | U08.1 45.57,15.65 45.34,15.88 30.35,15.88 | 30.35,15.88 v15.24,15.88 | U19.1 30.33,15.85 30.35,15.88
S0  (via drill 0.3)
  Top 0.152: v10.16,12.7 10.79,12.06 U104.15 12.45,12.06 12.7,12.32 12.7,15.24 11.43,16.51 v10.16,16.51 | v31.11,1.27 31.11,3.56 v31.37,3.81 | v28.45,19.05 29.21,18.29 v29.21,17.4
  Bottom 0.152: U28.10 44.72,24.39 44.45,24.13 44.45,17.78 44.2,17.53 29.84,17.53 29.72,17.4 v29.21,17.4 28.57,17.4 28.45,17.27 22.23,17.27 21.84,16.89 10.54,16.89 v10.16,16.51 | U08.10 44.33,9.15 43.94,8.76 43.94,3.17 42.04,1.27 v31.11,1.27 16.13,1.27 13.84,3.56 13.84,9.53 10.67,12.7 v10.16,12.7 | U19.10 31.23,9.15 31.37,9.02 v31.37,3.81 | U18.10 29.09,24.39 28.45,23.75 v28.45,19.05
S1  (via drill 0.3)
  Top 0.152: U104.1 v7.62,13.34 | v29.21,3.81 v29.21,0.64 | v29.34,19.05 29.34,18.8 30.48,17.65 v30.48,16.89
  Bottom 0.152: U28.11 46.49,23.75 46.61,23.62 46.61,17.14 46.35,16.89 v30.48,16.89 29.97,16.89 29.84,16.76 22.23,16.76 21.97,16.51 11.43,16.51 10.16,15.24 8.89,15.24 7.62,13.97 v7.62,13.34 7.62,12.83 8.38,12.06 10.79,12.06 13.46,9.4 13.46,3.3 16.13,0.64 v29.21,0.64 45.85,0.64 46.61,1.4 46.61,8.26 46.36,8.51 U08.11 | U19.11 29.46,8.51 29.21,8.26 v29.21,3.81 | U18.11 29.59,23.75 29.34,23.5 v29.34,19.05
S2  (via drill 0.3)
  Top 0.152: v8.89,16.51 v8.89,13.97 8.89,12.7 8.26,12.06 U104.2 | v21.59,3.81 v21.59,1.91 | v21.59,19.05 v21.59,17.78
  Bottom 0.152: U28.14 37.33,23.75 36.96,23.37 36.96,18.54 36.45,18.03 28.57,18.03 28.32,17.78 v21.59,17.78 | U08.14 36.95,8.51 36.58,8.13 36.58,3.05 35.43,1.91 v21.59,1.91 16.13,1.91 14.22,3.81 14.22,9.65 9.91,13.97 v8.89,13.97 | U19.14 21.97,8.51 21.59,8.13 v21.59,3.81 | U18.14 21.84,23.75 21.59,23.5 v21.59,19.05 | v21.59,17.78 21.59,18.03 | v21.59,17.78 21.08,17.27 9.27,17.27 8.89,16.89 v8.89,16.51
S3  (via drill 0.3)
  Top 0.152: v38.1,5.71 v23.01,5.71 v19.68,5.71 | U104.3 9.53,10.79 10.16,10.16 15.88,10.16 | v38.25,21.34 37.87,20.95 v22.99,20.95 19.94,20.95 v19.56,21.34 | v15.88,21.34 15.88,10.16 | 15.88,10.16 15.88,6.99 v16.51,6.35
  Bottom 0.152: U28.13 v38.25,21.34 | U19.13 v23.01,5.71 | U08.13 38.25,5.87 v38.1,5.71 | v16.51,6.35 16.51,5.97 16.76,5.71 v19.68,5.71 | U18.13 23.01,20.98 v22.99,20.95 | v19.56,21.34 v15.88,21.34
SCLK
  Top 0.152: J1.6 3.81,21.46 3.81,22.86 5.59,24.64 5.59,30.35 6.67,31.43 U106.4

### Text on the board
Top: X3r1
tPlace: Peter Jansen | (0,0) | (0,7) | Feb18 | GND | OUT | SCK | MISO | CS | !CLR | CLK | 3V3 | Magnetic Imager / Tile | (7,0) | (7,7)
bPlace: Magnetic Imager Tile
tDocu: Peter Jansen